# EAGLE design power_control_system (EAGLE 8.0.0)
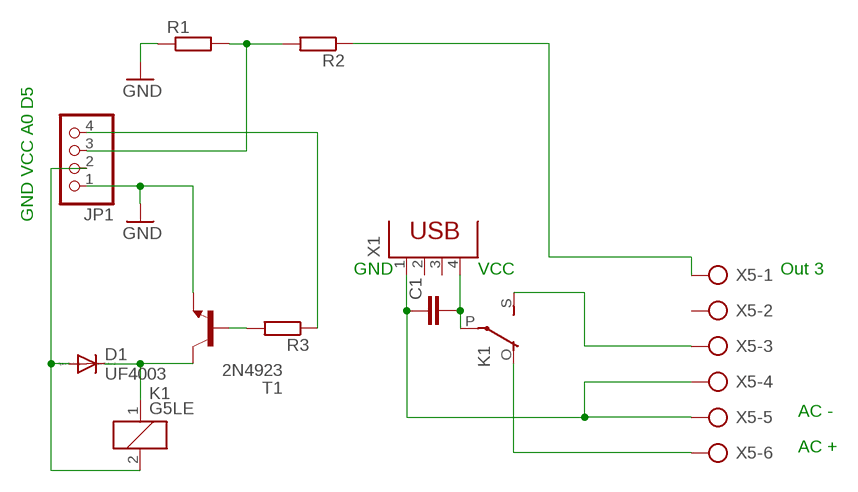
[diagram p0: schematic, sheet 1]

## Parts
C1  C2,5-3  [C2.5-3]
D1  UF4003  [DO41-10]
JP1  PINHD-1X4  [1X04]
K1  G5LE  [G5LE]
R1  R-EU_0204/2V  [0204V]
R2  R-EU_0204/2V  [0204V]
R3  R-EU_0204/2V  [0204V]
T1  2N4923  [TO126]
X1  PN87520  [PN87520]
X5  AK300/6  [AK300/6]

## Nets
GND: JP1.1 R1.1 T1.1(E)
N$1: JP1.3 R1.2 R2.2
N$2: JP1.4 R3.1
N$3: R3.2 T1.3(B)
N$4: D1.C K1.1 T1.2(C)
N$5: D1.A JP1.2 K1.2
N$6: C1.1 X1.1 X5.4 X5.5
N$7: C1.2 K1.P(2:P) X1.4
N$8: K1.O(2:O) X5.6
N$10: K1.S(2:S) X5.3
N$11: R2.1 X5.1
Unconnected: X1.2 X1.3 X5.2

## Notes on the sheet
- GND VCC A0 D5
- GND | VCC | Out 3
- AC -
- AC +

## Library data of the parts
C1 = capacitor-wima:C: CAPACITOR naming: grid - package width
D1 = diode:UF4003: DIODE ultrafast recovery diode, 200 V rectifier
JP1 = pinhead:PINHD-1X4: PIN HEADER
K1 = relay:G5LE: RELAY 1 x switch, 10 A/120 V AC, 8 A/30 V DC, Omron; OC_FARNELL: unknown; OC_NEWARK: unknown
R1-R3 = rcl:R-EU_: RESISTOR, European symbol
T1 = transistor:2N4923: NPN TRANSISTOR
X1 = con-berg:PN87520: BERG USB connector; OC_FARNELL: unknown; OC_NEWARK: unknown
X5 = con-ptr500:AK300/6: CONNECTOR; OC_FARNELL: unknown; OC_NEWARK: unknown

## Board
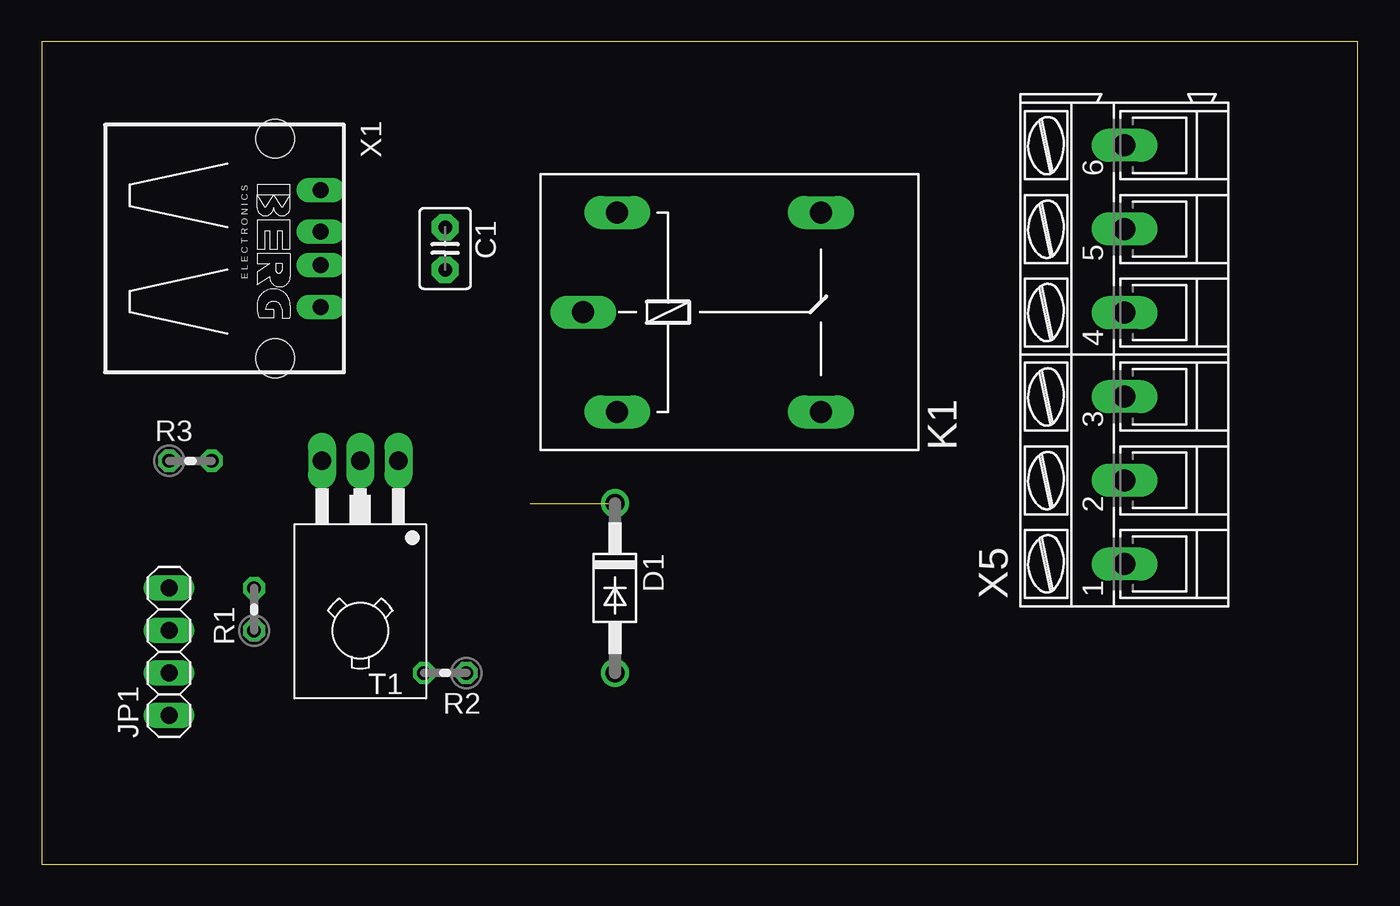
[diagram p1: board, top side]
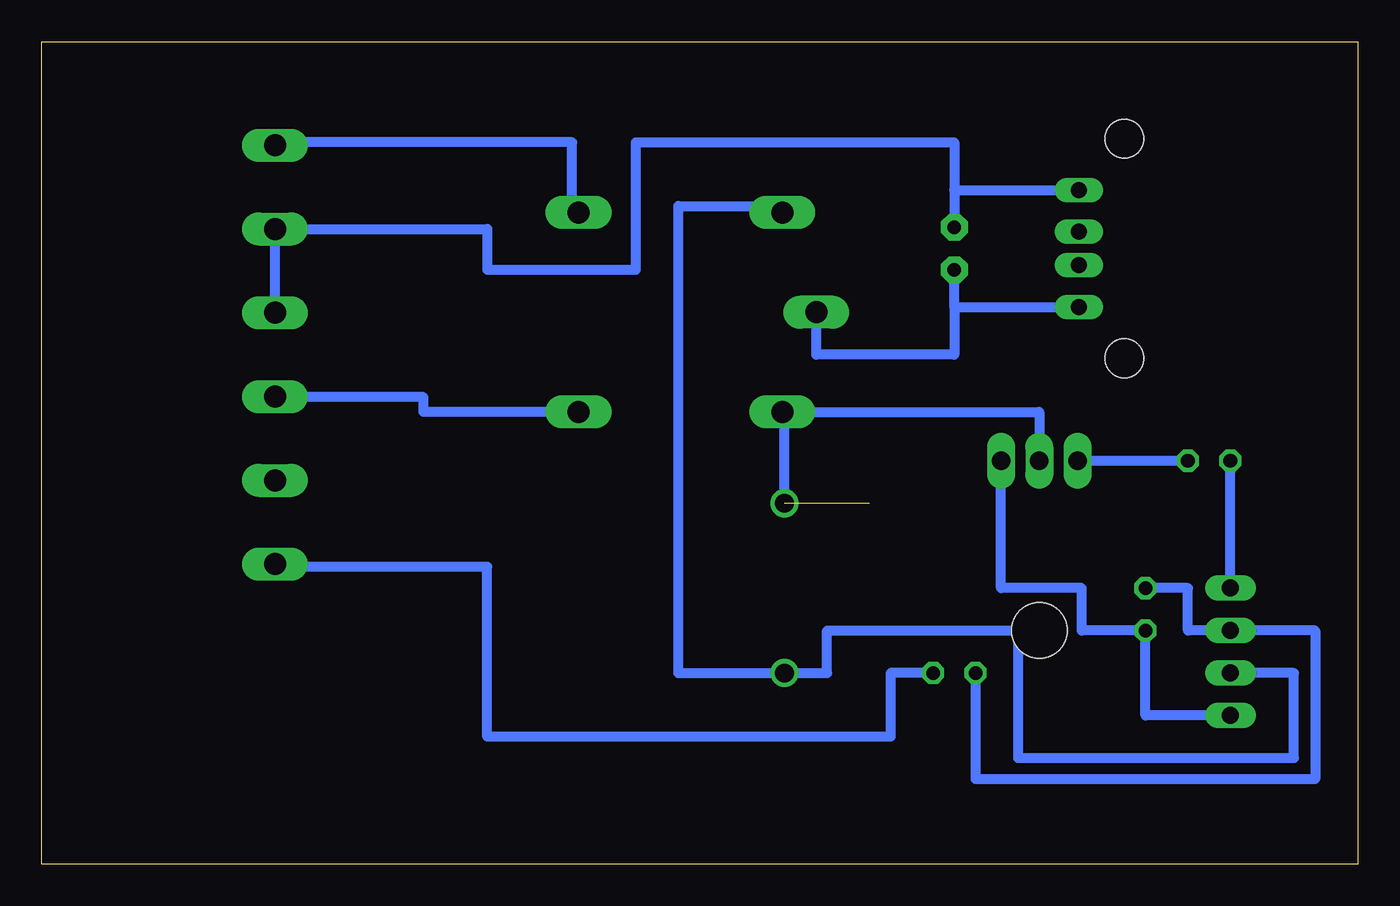
[diagram p2: board, bottom side, seen from below]

Size 78.72 x 49.2 mm. Coordinates in mm from the lower left corner, seen from the top.
Outline: 0,0 78.72,0 78.72,49.2 0,49.2 0,0
Copper layers (1*16): Top 0.035mm / dielectric 1.5mm / Bottom 0.035mm
Design rules "default": minimum track width 10mil, minimum drill 24mil, track to track 8mil, track to pad 8mil, pad to pad 8mil, via to via 8mil, smd to smd 8mil, copper to edge 40mil, drill to drill 8mil, minimum pad ring 10mil, minimum via ring 8mil, stop-mask expansion 4mil, vias tented up to drill 0mil, thermal gap 10mil

### Footprints (pad centres in the part's own frame; a part is rotated, then mirrored left to right if it is on the bottom)
C2.5-3 = drill 0.813 pad 1.6 octagon: 1 -1.27,0; 2 1.27,0
DO41-10 = drill 1.118: A 5.08,0; C -5.08,0
1X04 = drill 1.016 long: 1 -3.81,0; 2 -1.27,0; 3 1.27,0; 4 3.81,0
G5LE = drill 1.321 long: 1 -7.493,-5.969; 2 -7.493,5.969; O 4.699,5.969; P -9.525,0; S 4.699,-5.969
0204V = drill 0.813 octagon: 1 -1.27,0; 2 1.27,0
TO126 = drill 1.118 long: 1 -2.286,-5.08; 2 0,-5.08; 3 2.286,-5.08 | hole 3.302: 0,5.08
PN87520 = drill 0.95 long: 1 -3.5,2.71; 2 -1,2.71; 3 1,2.71; 4 3.5,2.71 | hole 2.3: -6.57,0; 6.57,0
AK300/6 = drill 1.321 long: 1 -12.522,0; 2 -7.518,0; 3 -2.515,0; 4 2.515,0; 5 7.518,0; 6 12.522,0

### Placement (x,y rotation side)
C1  24.13,36.83 270 top
D1  34.29,16.51 270 top
JP1  7.62,12.7 90 top
K1  41.91,33.02 0 top
R1  12.7,15.24 90 top
R2  24.13,11.43 180 top
R3  8.89,24.13 0 top
T1  19.05,19.05 180 top
X1  13.97,36.83 270 top
X5  64.77,30.48 90 top

### Tracks (layer width: path | path; a pad name or v marks a point on that pad's centre or on a via)
GND
  Bottom 0.61: JP1.1 12.7,8.89 R1.1 16.51,13.97 16.51,16.51 21.34,16.51 T1.1
N$1
  Bottom 0.61: R2.2 22.86,5.08 2.54,5.08 2.54,13.97 JP1.3 10.16,13.97 10.16,16.51 R1.2
N$2
  Bottom 0.61: JP1.4 R3.1
N$3
  Bottom 0.61: R3.2 T1.3
N$4  (1 unrouted)
  Bottom 0.61: D1.C 34.29,27.05 K1.1 19.05,27.05 T1.2
N$5
  Bottom 0.61: K1.2 34.42,39.37 40.64,39.37 40.64,11.43 D1.A 31.75,11.43 31.75,13.97 20.32,13.97 20.32,6.35 3.81,6.35 3.81,11.43 JP1.2
N$6
  Bottom 0.61: 24.13,40.33 X1.1 | 24.13,40.33 C1.1 | X5.4 X5.5 52.07,38 52.07,35.56 43.18,35.56 43.18,43.18 24.13,43.18 24.13,40.33
N$7
  Bottom 0.61: 24.13,33.33 X1.4 | 24.13,33.33 C1.2 | 24.13,33.33 24.13,30.48 32.38,30.48 K1.P
N$8
  Bottom 0.61: K1.O 46.99,38.99 46.99,43.18 64.77,43.18 X5.6
N$10
  Bottom 0.61: K1.S 55.88,27.05 55.88,27.94 64.77,27.94 X5.3
N$11
  Bottom 0.61: R2.1 27.94,11.43 27.94,7.62 52.07,7.62 52.07,17.78 64.77,17.78 X5.1